# Altium schematic sheet BatteryVCsmooth.SchDoc
size A; SheetNumber: 1; SheetTotal: 1
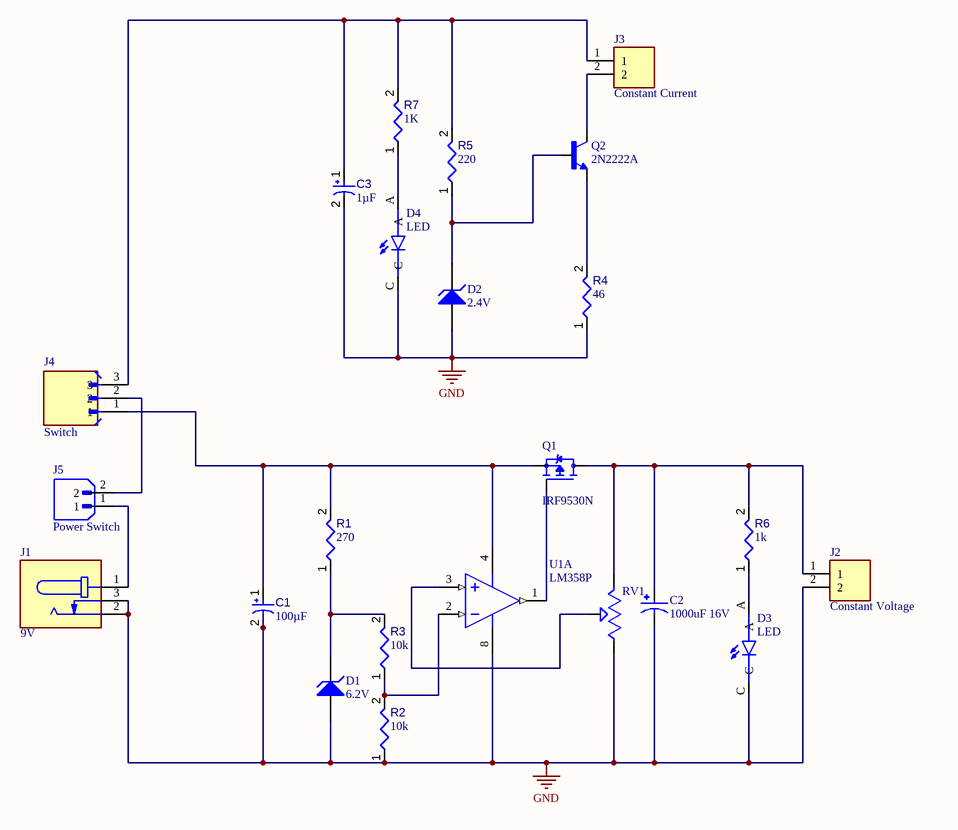
[diagram p0: BatteryVCsmooth.SchDoc]

## Parts
C1  value 100µF  [CAPPR65-350-1150X800X1250]  (hidden comment: ECA1HM101)
C2  1000uF 16V  [CAPPRD500W60D1000H2000]
C3  value 1µF  [CAPPR55-200-1100X500X1200]  (hidden comment: ECA-1HHG010)
D1  6.2V  [FAIR-DO-35-2]
D2  2.4V  [FAIR-DO-35-2]
D3  LED  [LED_WP7113ID]
D4  LED  [LED_WP7113ID]
J1  9V  [CUI_PJ-035C]
J2  Constant Voltage  [TE_282841-2]
J3  Constant Current  [TE_282841-2]
J4  Switch  [JST_B3B-PH-K-S]
J5  Power Switch  [JST_B2B-XH-A(LF)(SN)]
Q1  IRF9530N  [TO220V]
Q2  2N2222A  [TO92254P470H750-3]
R1  value 270  [RESA60-630X240]  (hidden comment: MFR-25FBF52-270)
R2  value 10k  [RESA60-630X240]  (hidden comment: MFR-25FBF52-10k)
R3  value 10k  [RESA60-630X240]  (hidden comment: MFR-25FBF52-10k)
R4  value 46  [RESA60-630X240]  (hidden comment: MFR-25FBF52-46)
R5  value 220  [RESA60-630X240]  (hidden comment: MFR-25FBF52-220)
R6  value 1k  [RESA60-630X240]  (hidden comment: MFR-25FBF52-1k)
R7  value 1K  [RESA60-630X240]  (hidden comment: MFR-25FBF52-1k)
RV1  (no value)  [TRIM_PV36W254C01B00]
U1  LM358P  [P0008A]  (part A of 2)

## Nets
GND: C1.2 C2.N C3.2 D1.1(A) D2.1(A) D3.C D4.C J1.2 J1.3 J2.2 R2.1 R4.1 RV1.1 U1.8(VCC)
NetC1_1: C1.1 J4.1 Q1.3(S) R1.2 U1.4(GND)
NetC2_P: C2.P J2.1 Q1.2(D) R6.2 RV1.3
NetC3_1: C3.1 J3.1 J4.3 R5.2 R7.2
NetD1_2: D1.2(K) R1.1 R3.2
NetD2_2: D2.2(K) Q2.2(B) R5.1
NetD3_A: D3.A R6.1
NetD4_A: D4.A R7.1
NetJ1_1: J1.1 J5.1
NetJ3_2: J3.2 Q2.3(C)
NetJ4_2: J4.2 J5.2
NetQ1_1: Q1.1(G) U1.1(1OUT)
NetQ2_1: Q2.1(E) R4.2
NetR2_2: R2.2 R3.1 U1.2(1IN-)
NetRV1_2: RV1.2 U1.3(1IN+)

## Library data of the parts
C1 = CMP-001-00026-7: Aluminum Electrolytic Capacitor, 100 uF, +/- 20%, 50 V, -40 to 85 degC, 2-Pin THD, RoHS, Bulk; Manufacturer: Panasonic; Voltage Rating: 50V; Ripple Current: 250mA; Datasheet URL: https://industrial.panasonic.com/cdbs/www-data/pdf/RDF0000/ABA0000C1218.pdf; Lead Pitch: 3.5mm; Mounting Technology: TH; Package Description: 2-Pin Radial Lead, Dia 8 mm, Height 12.5 mm; Diameter: 8mm; Ripple Current (AC): 250mA; Manufacturer URL: http://www.panasonic.com/; Capacitor Type: Electrolytic; Max Operating Temperature: 85°C; Pins: 2; Min Operating Temperature: -40°C; Tolerance: 20%; Case/Package: Radial; Packaging: Bulk; Package Quantity: 200; Package Reference: CAPPR65-350-1150X800X1250; RoHS Compliant: True; Datasheet Version: Rev. 05, 10/2016
C2 = EEUEB1C102B: 1000F 16V Aluminum Electrolytic Capacitors Radial, Can 10000 Hrs @ 105C; MP: EEU-EB1C102B; MF: Panasonic; Purchase-URL: https://pricing.snapeda.com/search/part/EEU-EB1C102B/?ref=eda; Package: RADIAL-2 Panasonic; SnapEDA_Link: https://www.snapeda.com/parts/EEU-EB1C102B/Panasonic/view-part/2309636/?ref=snap; Availability: In Stock; Price: None; Value: *; Check_prices: https://www.snapeda.com/parts/EEU-EB1C102B/Panasonic/view-part/2309636/?ref=eda
C3 = CMP-001-00024-7: Aluminum Electrolytic Capacitor, 1 uF, +/- 20%, 50 V, -55 to 105 degC, 2-Pin THD, RoHS, Bulk; Manufacturer: Panasonic; Voltage Rating: 50V; Ripple Current: 10mA; Packaging: Bulk; Package Quantity: 200; Tolerance: 20%; Min Operating Temperature: -55°C; Diameter: 5mm; Capacitor Type: Electrolytic; Datasheet Version: Mar-05; Ripple Current (AC): 10mA; Manufacturer URL: http://www.panasonic.com/; Case/Package: Radial; Mounting Technology: TH; Pins: 2; Package Reference: CAPPR55-200-1100X500X1200; Package Description: 2-Pin Radial Lead, Dia 5 mm, Height 12 mm; RoHS Compliant: True; Max Operating Temperature: 105°C; Lead Pitch: 2mm; Datasheet URL: https://datasheet.ciiva.com/7275/94060-7275472.pdf
D1 = CMP-004-00021-2: Zener Diode, 6.1 V, 5 mA, -65 to 200 degC, 2-Pin DO-35, RoHS, Bulk; Manufacturer: Fairchild Semiconductor; Tolerance: 6%; Power: 500mW; Forward Voltage: 1.5V; Impedance: 90Ohm; Package Quantity: 1000; Min Operating Temperature: -65°C; Datasheet Version: Rev. C1, 07/2007; Max Operating Temperature: 200°C; Mounting Technology: TH; Package Description: 2-Pin Through Hole Diode, Dia 1.72 mm, Body Length 3.805 mm; RoHS Compliant: True; Manufacturer URL: https://www.fairchildsemi.com/; Package Reference: DO-35-2; Case/Package: DO-35-2; Datasheet URL: https://www.fairchildsemi.com/datasheets/BZ/BZX79C3V6.pdf; Package URL: https://www.fairchildsemi.com/package-drawings/DO/DO35A.pdf; Pins: 2; Packaging: Bulk
D2 = CMP-004-00021-2: Zener Diode, 2.4 V, 5 mA, -65 to 200 degC, 2-Pin DO-35, RoHS, Bulk; Manufacturer: Fairchild Semiconductor; Tolerance: 6%; Power: 500mW; Forward Voltage: 1.5V; Impedance: 90Ohm; Package Quantity: 1000; Min Operating Temperature: -65°C; Datasheet Version: Rev. C1, 07/2007; Max Operating Temperature: 200°C; Mounting Technology: TH; Package Description: 2-Pin Through Hole Diode, Dia 1.72 mm, Body Length 3.805 mm; RoHS Compliant: True; Manufacturer URL: https://www.fairchildsemi.com/; Package Reference: DO-35-2; Case/Package: DO-35-2; Datasheet URL: https://www.fairchildsemi.com/datasheets/BZ/BZX79C3V6.pdf; Package URL: https://www.fairchildsemi.com/package-drawings/DO/DO35A.pdf; Pins: 2; Packaging: Bulk
D3 D4 = WP7113ID: Red 617nm LED Indication - Discrete 2V Radial; MF: Kingbright; Price: None; MP: WP7113ID; Package: Radial Kingbright; Check_prices: https://www.snapeda.com/parts/WP7113ID/Kingbright/view-part/?ref=eda; Purchase-URL: https://pricing.snapeda.com/search/part/WP7113ID/?ref=eda; Availability: In Stock; Value: *; SnapEDA_Link: https://www.snapeda.com/parts/WP7113ID/Kingbright/view-part/?ref=snap
J1 = PJ-035C: MF: {'manufacturer': u'CUI Devices'}; Package: None; Price: None; Value: *; MP: PJ-035C; Availability: Unavailable
J2 J3 = 282841-2: Conn Terminal Block 2 POS 5.08mm Solder ST Thru-Hole 17.5A/Contact; MF: TE Connectivity; Purchase-URL: https://pricing.snapeda.com/search/part/282841-2/?ref=eda; SnapEDA_Link: https://www.snapeda.com/parts/282841-2/TE+Connectivity+AMP+Connectors/view-part/?ref=snap; MP: 282841-2; Package: None; Check_prices: https://www.snapeda.com/parts/282841-2/TE+Connectivity+AMP+Connectors/view-part/?ref=eda; EU_RoHS_Compliance: Compliant with Exemptions; Price: None; Availability: In Stock; Value: *
J4 = B3B-PH-K-S: MF: {'manufacturer': u'JST Sales America Inc.'}; Package: None; Price: None; Value: *; MP: B3B-PH-K-S; Availability: Unavailable
J5 = B2B-XH-A(LF)(SN): Connector Header Through Hole 2 position 0.098 (2.50mm); MF: JST Sales America Inc.; SnapEDA_Link: https://www.snapeda.com/parts/B2B-XH-A(LF)(SN)/JST+Sales+America+Inc./view-part/?ref=snap; Package: None; Value: *; MP: B2B-XH-A(LF)(SN); Check_prices: https://www.snapeda.com/parts/B2B-XH-A(LF)(SN)/JST+Sales+America+Inc./view-part/?ref=eda
Q1 = IRF9530NPBF: Canal P 100 V 14A (Tc) 79W (Tc) Orificio pasante TO-220AB; MF: Infineon; Package: TO-220 Infineon; Digi-Key_Part_Number: IRF9530NPBF-ND; Check_prices: https://www.snapeda.com/parts/IRF9530NPBF/Infineon+Technologies/view-part/?ref=eda; Value: *; MP: IRF9530NPBF; SnapEDA_Link: https://www.snapeda.com/parts/IRF9530NPBF/Infineon+Technologies/view-part/?ref=snap; Purchase-URL: https://pricing.snapeda.com/search/part/IRF9530NPBF/?ref=eda
Q2 = 2N2222A: Bipolar (BJT) Transistor NPN 40 V 600 mA 250MHz 625 mW Through Hole TO-92; MF: Diotec Semiconductor; Package: TO-92-3 Diotec; Check_prices: https://www.snapeda.com/parts/2N2222A/Diotec/view-part/?ref=eda; Value: *; Purchase-URL: https://pricing.snapeda.com/search/part/2N2222A/?ref=eda; Availability: In Stock; SnapEDA_Link: https://www.snapeda.com/parts/2N2222A/Diotec/view-part/?ref=snap; MP: 2N2222A; Price: None
R1 = CMP-009-00045-4: Axial Resistor, 270Ohm, +/- 1%, 0.25 W, -55 to 155 degC, 2-Pin THD, RoHS, Bulk; Manufacturer: Yageo; Power: 250mW; Voltage Rating: 250V; Case/Package: Axial; Max Operating Temperature: 155°C; Package Reference: MFR-25; Package Quantity: 200; Package Description: 2-Pin Axial Lead, Dia 2.4 mm, Body Length 6.3 mm; Tolerance: 1%; Manufacturer URL: http://www.yageo.com/; Packaging: Bulk; Mounting Technology: TH; Min Operating Temperature: -55°C; RoHS Compliant: True; Datasheet Version: Apr-13; Datasheet URL: http://www.yageo.com/documents/recent/Yageo%20LR_MFR_2013.pdf
R2 R3 = CMP-009-00045-4: Axial Resistor, 10kOhm, +/- 1%, 0.25 W, -55 to 155 degC, 2-Pin THD, RoHS, Bulk; Manufacturer: Yageo; Power: 250mW; Voltage Rating: 250V; Case/Package: Axial; Max Operating Temperature: 155°C; Package Reference: MFR-25; Package Quantity: 200; Package Description: 2-Pin Axial Lead, Dia 2.4 mm, Body Length 6.3 mm; Tolerance: 1%; Manufacturer URL: http://www.yageo.com/; Packaging: Bulk; Mounting Technology: TH; Min Operating Temperature: -55°C; RoHS Compliant: True; Datasheet Version: Apr-13; Datasheet URL: http://www.yageo.com/documents/recent/Yageo%20LR_MFR_2013.pdf
R4 = CMP-009-00045-4: Axial Resistor, 46Ohm, +/- 1%, 0.25 W, -55 to 155 degC, 2-Pin THD, RoHS, Bulk; Manufacturer: Yageo; Power: 250mW; Voltage Rating: 250V; Case/Package: Axial; Max Operating Temperature: 155°C; Package Reference: MFR-25; Package Quantity: 200; Package Description: 2-Pin Axial Lead, Dia 2.4 mm, Body Length 6.3 mm; Tolerance: 1%; Manufacturer URL: http://www.yageo.com/; Packaging: Bulk; Mounting Technology: TH; Min Operating Temperature: -55°C; RoHS Compliant: True; Datasheet Version: Apr-13; Datasheet URL: http://www.yageo.com/documents/recent/Yageo%20LR_MFR_2013.pdf
R5 = CMP-009-00045-4: Axial Resistor, 220Ohm, +/- 1%, 0.25 W, -55 to 155 degC, 2-Pin THD, RoHS, Bulk; Manufacturer: Yageo; Power: 250mW; Voltage Rating: 250V; Case/Package: Axial; Max Operating Temperature: 155°C; Package Reference: MFR-25; Package Quantity: 200; Package Description: 2-Pin Axial Lead, Dia 2.4 mm, Body Length 6.3 mm; Tolerance: 1%; Manufacturer URL: http://www.yageo.com/; Packaging: Bulk; Mounting Technology: TH; Min Operating Temperature: -55°C; RoHS Compliant: True; Datasheet Version: Apr-13; Datasheet URL: http://www.yageo.com/documents/recent/Yageo%20LR_MFR_2013.pdf
R6 R7 = CMP-009-00045-4: Axial Resistor, 1kOhm, +/- 1%, 0.25 W, -55 to 155 degC, 2-Pin THD, RoHS, Bulk; Manufacturer: Yageo; Power: 250mW; Voltage Rating: 250V; Case/Package: Axial; Max Operating Temperature: 155°C; Package Reference: MFR-25; Package Quantity: 200; Package Description: 2-Pin Axial Lead, Dia 2.4 mm, Body Length 6.3 mm; Tolerance: 1%; Manufacturer URL: http://www.yageo.com/; Packaging: Bulk; Mounting Technology: TH; Min Operating Temperature: -55°C; RoHS Compliant: True; Datasheet Version: Apr-13; Datasheet URL: http://www.yageo.com/documents/recent/Yageo%20LR_MFR_2013.pdf
RV1 = PV36W254C01B00: 100 kOhms 0.5W, 1/2W PC Pins Through Hole Trimmer Potentiometer Cermet 25.0 Turn Top Adjustment; MF: Bourns; SnapEDA_Link: https://www.snapeda.com/parts/PV36W254C01B00/Bourns/view-part/?ref=snap; Package: PV36W Bourns; Value: *; MP: PV36W254C01B00; Check_prices: https://www.snapeda.com/parts/PV36W254C01B00/Bourns/view-part/?ref=eda
U1 = CMP-014-00023-2: Dual Operational Amplifier, 3 to 32 V, 0 to 70 degC, 8-Pin PDIP (P), Pb-Free (RoHS), Tube; Manufacturer: Texas Instruments (TI); Channels: 2; Max Dual Supply Voltage: 16V; Min Dual Supply Voltage: 1.5V; Slew Rate: 0.3V/us; Unity Gain Bandwidth Product: 700KHz; Common Mode Rejection Ratio: 65dB; Nominal Supply Voltage: 5V; Package Version: 4040082/E, 04/2010; Output Current: 30mA; Nominal Supply Current: 1.2mA; Nominal Voltage Gain: 100dB; Case/Package: DIP; Max Operating Temperature: 70°C; RoHS Compliant: True; Manufacturer URL: http://www.ti.com/; Pins: 8; Package Description: 8-Pin Double In-line Package, Body 9.59 x 6.35 mm, Pitch 2.54 mm; Datasheet URL: http://www.ti.com/lit/ds/symlink/lm358a.pdf; Max Supply Voltage: 16V; Package Reference: P0008A; Mounting Technology: TH; Min Operating Temperature: 0°C; Package URL: http://www.ti.com/lit/ml/mpdi001b/mpdi001b.pdf; Min Supply Voltage: 1.5V; Package Quantity: 50; Packaging: Rail/Tube; Datasheet Version: SLOS068T, 04/2015; Nominal Gain Bandwith Product: 700KHz